# Altium project BicycleGauge Magnetic Switch.PrjPcb
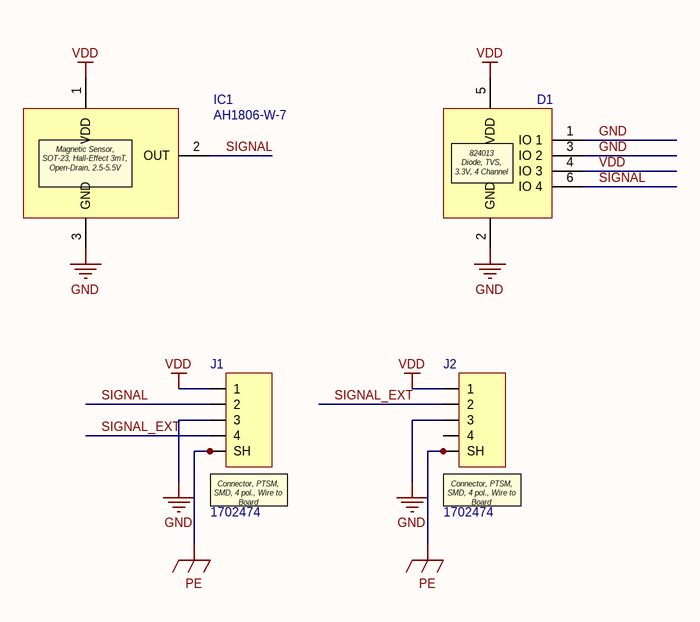
[diagram p0: Main.SchDoc]
Address1: -; Address2: -; Address3: -; Address4: -; ApprovedBy: -; DrawnBy: Sven Möller; Organization: Private; ProjectName: Bicycle Gauge Magnetic Switch; Revision: v1.0; ShortName: SM; Title: Bicycle Gauge Magnetic Switch
1 sheet, 4 parts. Net scope: global (net labels, ports and power ports of the same name join across sheets).

## Sheet Main.SchDoc: Bicycle Gauge Magnetic Switch
size A4; ApprovedBy: -; DrawnBy: Sven Möller; Organization: Private; Address1: -; Address2: -; Address3: -; Address4: -; DocumentNumber: 1; Revision: v1.0; SheetNumber: 1; SheetTotal: 1; ProjectName: Bicycle Gauge Magnetic Switch

### Parts
D1  824013  [SOT-23-6]  (value not drawn)
IC1  AH1806-W-7  [SOT-23]
J1  1702474  [1702474]
J2  1702474  [1702474]

### Nets
GND: D1.1(IO_1) D1.2(GND) D1.3(IO_2) IC1.3(GND) J1.3 J2.3
PE: J1.SH1(SH) J1.SH2 J2.SH1(SH) J2.SH2
VDD: D1.4(IO_3) D1.5(VDD) IC1.1(VDD) J1.1 J2.1
SIGNAL: D1.6(IO_4) IC1.2(OUT) J1.2
SIGNAL_EXT: J1.4 J2.2

Not connected (* = marked no-connect by the designer): J2 4

### Notes on the sheet
- Title
- Size:
- Date:
- A4
- Time:
- Revision:
- Sheet
- of
- Drawn by:
- Approved by:
- File:
- (in symbol 824013) 824013 / Diode, TVS, 3.3V, 4 Channel

### Library data of the parts
D1 = 824013: Diode, TVS, 3.3V, 4 Channel; Manufacturer: Würth Electronics; ComponentLink1URL: P:/824013.pdf; ComponentLink1Description: Datasheet; OC_FEPA: *; MPN: 824013; Supplier 1: Digi-Key; Supplier Part Number 1: 732-4466-1-ND; Supplier 2: Farnell; Supplier Part Number 2: 1825869; Supplier 3: Mouser; Supplier Part Number 3: 710-824013; Supplier 4: RSComponents; Supplier Part Number 4: 7546222
IC1 = AH1806-W-7: Magnetic Sensor, SOT-23, Hall-Effect 3mT, Open-Drain, 2.5-5.5V; Manufacturer: Diodes Inc.; ComponentLink1URL: https://www.diodes.com/assets/Datasheets/AH1806.pdf; ComponentLink1Description: Datasheet; OC_FEPA: *; Supplier 1: Digi-Key; Supplier Part Number 1: AH1806-W-7DICT-ND; Supplier 2: Farnell; Supplier Part Number 2: -; Supplier 3: Mouser; Supplier Part Number 3: 621-AH1806-W-7; MPN: AH1806-W-7
J1 J2 = 1702474: Connector, PTSM, SMD, 4 pol., Wire to Board; Manufacturer: Phoenix Contact; ComponentLink1URL: P:/1702474.pdf; ComponentLink1Description: Datasheet; OC_FEPA: *; ComponentLink3Description: Drawing; ComponentLink3URL: P:/pxc_1702474_00_PTSM-0-5-4-2-5-H-SMD-R24_FAM.pdf; Supplier 1: Digi-Key; Supplier Part Number 1: 277-2338-1-ND; Supplier 2: Farnell; Supplier Part Number 2: -; Supplier 3: Mouser; Supplier Part Number 3: 651-1702474; Supplier 4: RSComponents; Supplier Part Number 4: 804-5449; MPN: 1702474